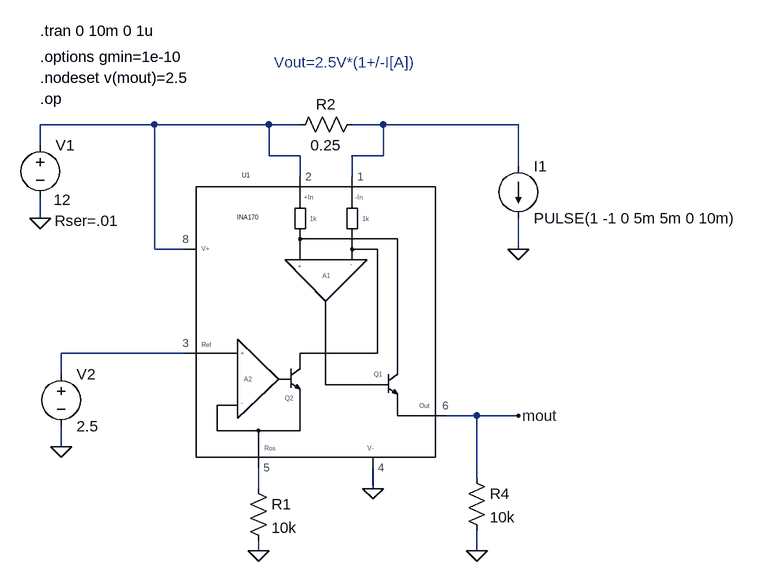
[diagram p0: schematic INA170_test.asc]
INA170_test.asc, the LTspice schematic file:
Version 4
SHEET 1 1092 680
WIRE 128 -192 -48 -192
WIRE 304 -192 128 -192
WIRE 352 -192 304 -192
WIRE 480 -192 432 -192
WIRE 688 -192 480 -192
WIRE -48 -160 -48 -192
WIRE 304 -144 304 -192
WIRE 352 -144 304 -144
WIRE 480 -144 480 -192
WIRE 480 -144 432 -144
WIRE 688 -128 688 -192
WIRE 352 -112 352 -144
WIRE 432 -112 432 -144
WIRE -48 -48 -48 -80
WIRE 128 0 128 -192
WIRE 176 0 128 0
WIRE 688 0 688 -48
WIRE 176 160 -16 160
WIRE -16 192 -16 160
WIRE 624 256 576 256
WIRE 688 256 624 256
WIRE -16 304 -16 272
WIRE 624 352 624 256
WIRE 288 368 288 336
WIRE 464 368 464 336
WIRE 288 464 288 448
WIRE 624 464 624 432
FLAG -48 -48 0
FLAG -16 304 0
FLAG 624 464 0
FLAG 288 464 0
FLAG 464 368 0
FLAG 688 256 mout
FLAG 688 0 0
SYMBOL res 336 -176 R270
WINDOW 0 32 56 VTop 2
WINDOW 3 0 56 VBottom 2
SYMATTR InstName R2
SYMATTR Value 0.25
SYMBOL voltage -48 -176 R0
WINDOW 3 21 100 Left 2
WINDOW 123 0 0 Left 2
WINDOW 39 22 132 Left 2
SYMATTR Value 12
SYMATTR SpiceLine Rser=.01
SYMATTR InstName V1
SYMBOL voltage -16 176 R0
SYMATTR InstName V2
SYMATTR Value 2.5
SYMBOL res 272 352 R0
SYMATTR InstName R1
SYMATTR Value 10k
SYMBOL res 608 336 R0
SYMATTR InstName R4
SYMATTR Value 10k
SYMBOL current 688 -128 R0
WINDOW 123 0 0 Left 2
WINDOW 39 24 28 Left 2
SYMATTR InstName I1
SYMATTR Value PULSE(1 -1 0 5m 5m 0 10m)
SYMBOL addon\\Opamps\\Instrumentation\\INA170 352 128 R0
SYMATTR InstName U1
TEXT -48 -232 Left 2 !.op
TEXT -48 -296 Left 2 !.options gmin=1e-10
TEXT -48 -264 Left 2 !.nodeset v(mout)=2.5
TEXT 312 -288 Left 2 ;Vout=2.5V*(1+/-I[A])
TEXT -48 -336 Left 2 !.tran 0 10m 0 1u

The netlist it stands for:
* INA170_test.asc
R2 N001 N002 0.25
V1 N001 0 12 Rser=.01
V2 N003 0 2.5
R1 N004 0 10k
R4 mout 0 10k
I1 N002 0 PULSE(1 -1 0 5m 5m 0 10m)
XU1 N002 N001 N003 0 N004 mout N001 INA170  ; pins 1 2 3 4 5 6 8
.op
.options gmin=1e-10
.nodeset v(mout)=2.5
* Vout=2.5V*(1+/-I[A])
.tran 0 10m 0 1u
.lib INA170.mod
.backanno
.end